# EAGLE design PowerNode (EAGLE 6.5.0)
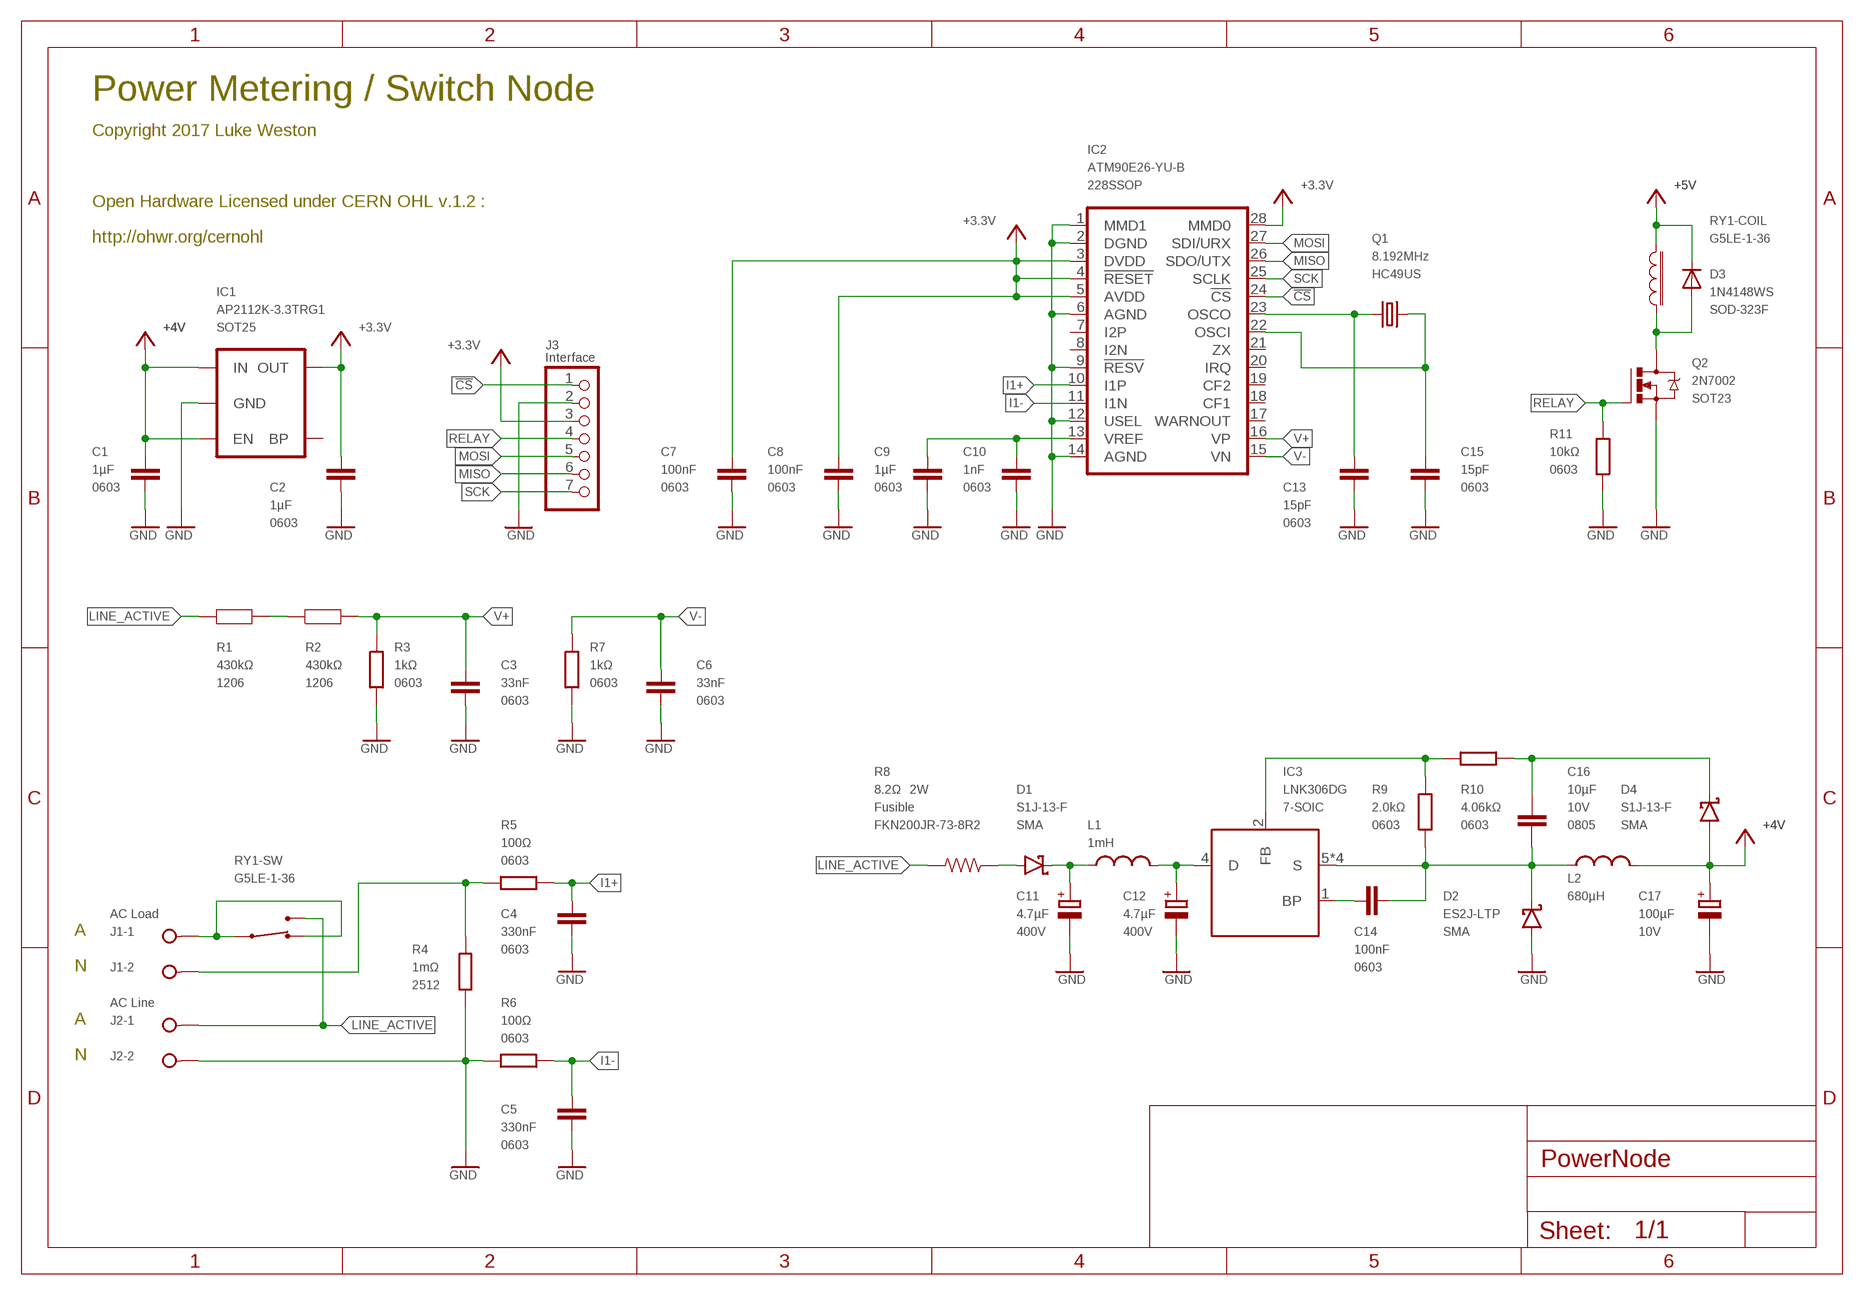
[diagram p0: schematic, sheet 1]

## Parts
C1  1µF  C0603  [0603]
C2  1µF  C0603  [0603]
C3  33nF  C0603  [0603]
C4  330nF  C0603  [0603]
C5  330nF  C0603  [0603]
C6  33nF  C0603  [0603]
C7  100nF  C0603  [0603]
C8  100nF  C0603  [0603]
C9  1µF  C0603  [0603]
C10  1nF  C0603  [0603]
C11  4.7µF  ELECTROLYTIC3.5MM  [ELECTRO-LARGE]
C12  4.7µF  ELECTROLYTIC3.5MM  [ELECTRO-LARGE]
C13  15pF  C0603  [0603]
C14  100nF  C0603  [0603]
C15  15pF  C0603  [0603]
C16  10µF  CAP0805  [0805]
C17  100µF  ELECTROLYTIC2MM  [ELECTRO-SMALL]
D1  S1J-13-F  SCHOTTKY-SMA  [SMA]
D2  ES2J-LTP  SCHOTTKY-SMA  [SMA]
D3  1N4148WS  DIODESOD  [SOD-323]
D4  S1J-13-F  SCHOTTKY-SMA  [SMA]
IC1  AP2112K-3.3TRG1  V_REG_LDOSMD  [SOT23-5]
IC2  ATM90E26-YU-B  ATM90E26  [SSOP-28]
IC3  LNK306DG  LNK304  [SO-8C]
J1  AC Load  W237-02P  [W237-132]
J2  AC Line  W237-02P  [W237-132]
J3  Interface  PINHD-1X7  [1X07]
L1  1mH  LRLB0608  [RLB0608]
L2  680µH  LRLB0914  [RLB0914]
Q1  8.192MHz  CRYSTALHC49S  [HC49/S]
Q2  2N7002  [SOT23-3]
R1  430kΩ  RESISTOR1206  [1206]
R2  430kΩ  RESISTOR1206  [1206]
R3  1kΩ  R0603  [0603]
R4  1mΩ  R-EU_R2512  [R2512]
R5  100Ω  R0603  [0603]
R6  100Ω  R0603  [0603]
R7  1kΩ  R0603  [0603]
R8  8.2Ω  RESISTORFKN200JR-73  [FKN200JR-73]
R9  2.0kΩ  R0603  [0603]
R10  4.06kΩ  R0603  [0603]
R11  10kΩ  R0603  [0603]
RY1  G5LE-1-36  G5LE  [G5LE]

## Nets
!CS: IC2.24(!CS) J3.1
+3.3V: C2.1 C7.2 C8.2 IC1.5(OUT) IC2.3(DVDD) IC2.4(!RESET) IC2.5(AVDD) IC2.28(MMD0) J3.3
+4V: C1.1 C17.+ D3.1(C) D4.A IC1.1(IN) IC1.3(EN) L2.2 RY1.COIL1 ; supply symbol labelled +5V
GND: C1.2 C2.2 C3.1 C4.1 C5.1 C6.1 C7.1 C8.1 C9.2 C10.1 C11.- C12.- C13.1 C15.1 C17.- D2.A IC1.2(GND) IC2.1(MMD1) IC2.2(DGND) IC2.6(AGND) IC2.9(!RESV) IC2.12(USEL) IC2.14(AGND) J2.2 J3.2 Q2.2(S) R3.2 R4.1 R6.2 R7.2 R11.1
I1+: C4.2 IC2.10(I1P) R5.1
I1-: C5.2 IC2.11(I1N) R6.1
LINE_ACTIVE: J2.1 R1.1 R8.1 RY1.NO(-SW:NO)
MISO: IC2.26(SDO/UTX) J3.6
MOSI: IC2.27(SDI/URX) J3.5
N$2: J1.1 RY1.COM(-SW:COM) RY1.NC(-SW:NC)
N$3: J1.2 R4.2 R5.2
N$8: D1.A R8.2
N$9: C11.+ D1.K L1.1
N$10: C12.+ IC3.4(D) L1.2
N$11: C14.1 IC3.1(BP)
N$12: C14.2 C16.1 D2.K IC3.5(S) IC3.6(S) IC3.7(S) IC3.8(S) L2.1 R9.1
N$15: IC3.2(FB) R9.2 R10.2
N$16: C16.2 D4.K R10.1
N$18: D3.2(A) Q2.3(D) RY1.COIL2
N$36: C13.2 IC2.23(OSCO) Q1.1
N$37: C15.2 IC2.22(OSCI) Q1.2
N$38: R1.2 R2.1
RELAY: J3.4 Q2.1(G) R11.2
SCK: IC2.25(SCLK) J3.7
V+: C3.2 IC2.16(VP) R2.2 R3.1
V-: C6.2 IC2.15(VN) R7.1
VREF: C9.1 C10.2 IC2.13(VREF)
Unconnected: IC1.4(BP) IC2.7(I2P) IC2.8(I2N) IC2.17(WARNOUT) IC2.18(CF1) IC2.19(CF2) IC2.20(IRQ) IC2.21(ZX)

## Notes on the sheet
- Power Metering / Switch Node
- Copyright 2017 Luke Weston
- Open Hardware Licensed under CERN OHL v.1.2 :
- http://ohwr.org/cernohl
- A
- N
- A
- N

## Library data of the parts
C1-C10 C13-C15 = freetronics-luke:C; PACKAGE: 0603
C11 C12 = freetronics-luke:ELECTROLYTIC: Electrolytic capacitor; VOLTAGE: 400V
C16 = freetronics-master-v1:CAP: Capacitor Standard 0603 ceramic capacitor, and 0.1" leaded capacitor.; PACKAGE: 0805; VOLTAGE: 10V
C17 = freetronics-luke:ELECTROLYTIC: Electrolytic capacitor; VOLTAGE: 10V
D1 D2 D4 = freetronics-luke:SCHOTTKY: Schottky diode; PACKAGE: SMA
D3 = SparkFun:DIODE: Diode These are standard reverse protection diodes and small signal diodes. SMA package can handle up to about 1A. SOD-323 can handle about 200mA. What the SOD-323 package when ordering, there are some mfgs out there that are 5-pin packages.; PACKAGE: SOD-323F
IC1 = SparkFun:V_REG_LDO: Voltage Regulator LDO Standard 150mA LDO voltage regulator in SOT-23 layout. Micrel part MIC5205. BP (by-pass) pin is used to lower output noise with 470pF cap.; PACKAGE: SOT25
IC2 = ATM90E26:ATM90E26: Single-Phase High-Per formance Wide-Span Energy Metering IC; PACKAGE: 228SSOP
IC3 = freetronics-luke:LNK304: LNK304 Off-Line Switchmode Controller; PACKAGE: 7-SOIC
J1 J2 = con-wago-508:W237-02P: WAGO SREW CLAMP; OC_FARNELL: unknown; OC_NEWARK: unknown
J3 = pinhead:PINHD-1X7: PIN HEADER
L1 L2 = freetronics-luke:L
Q1 = crystal:CRYSTAL: CRYSTAL; OC_FARNELL: 1667008; OC_NEWARK: unknown; PACKAGE: HC49US; PARTNO: 9B-4.096MBBK-B
Q2 = freetronics-luke:2N7002: 2N7002 N-ch MOSFET in SOT-23.; PACKAGE: SOT23
R1 R2 = freetronics-master-v1:RESISTOR: Resistor Basic schematic elements and footprints for 0603, 1206, and PTH 1/10th watt (small) resistors.; PACKAGE: 1206; POWER: 1/4W; TOLERANCE: 1%
R3 R5-R7 R9-R11 = freetronics-luke:R; PACKAGE: 0603
R4 = rcl:R-EU_: RESISTOR, European symbol; PACKAGE: 2512; POWER: 1W; TOLERANCE: 1%
R8 = freetronics-luke:RESISTOR: Resistor Basic schematic elements and footprints for 0603, 1206, and PTH 1/10th watt (small) resistors.; FOO: Fusible; ID: FKN200JR-73-8R2; POWER: 2W
RY1 = freetronics-luke:G5LE

## Net classes
0 default: width 0.152 mm, drill 0.241 mm, clearance 0.152 mm
1 pwr: width 0.356 mm, drill 0.33 mm, clearance 0.254 mm
2 gnd: width 0.152 mm, drill 0.305 mm, clearance 0.152 mm

## Board
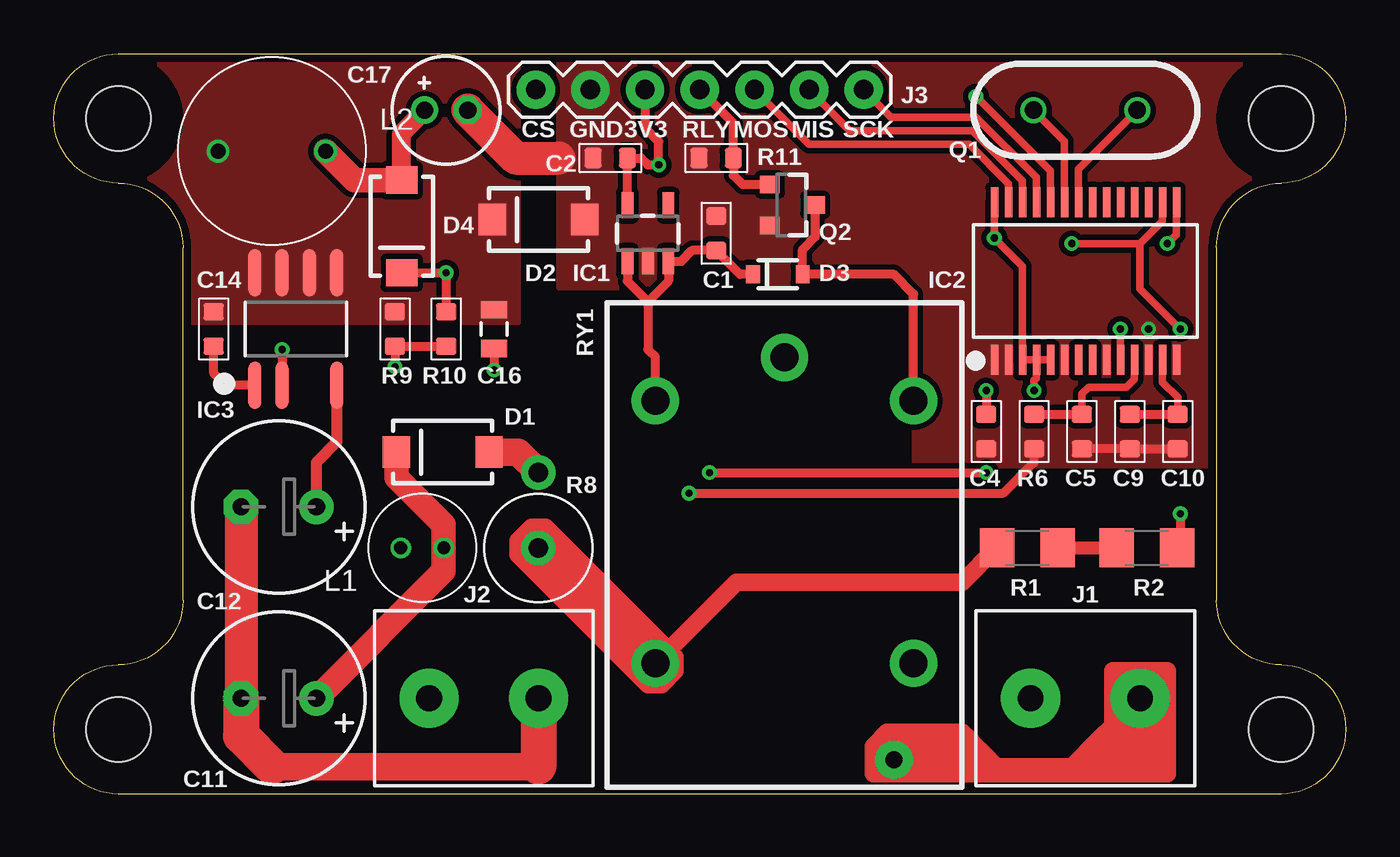
[diagram p1: board, top side]
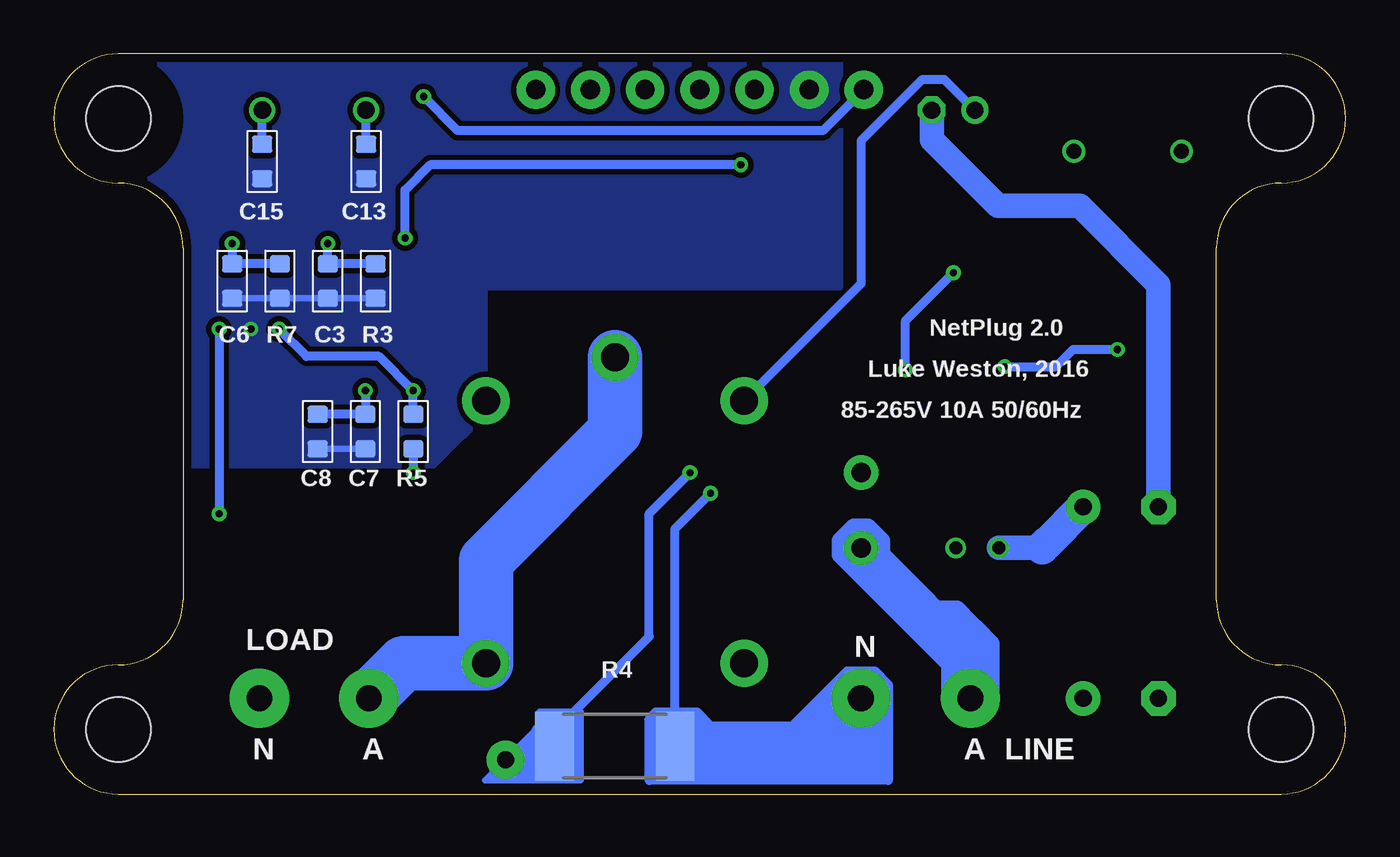
[diagram p2: board, bottom side, seen from below]

Size 60 x 34.37 mm. Coordinates in mm from the lower left corner, seen from the top.
Outline: 3,34.37 57,34.37 arc-90 60,31.36 arc-90 57,28.36 arc90 54,25.36 54,9 arc90 57,6 arc-90 60,3 arc-90 57,0 3,0 arc-90 0,3 arc-90 3,6 arc90 6,9 6,25.36 arc90 3,28.36 arc-90 0,31.36 arc-90 3,34.37
Copper layers (1*16): Top 0.0356mm / dielectric 1.5011mm / Bottom 0.0356mm
Design rules "LaenPCBOrder *": minimum track width 6mil, minimum drill 13mil, track to track 6mil, track to pad 6mil, pad to pad 6mil, via to via 6mil, smd to smd 6mil, copper to edge 15mil, drill to drill 6mil, minimum pad ring 7mil, minimum via ring 7mil, stop-mask expansion 3mil, vias tented up to drill 14mil, thermal gap 10mil
Holes 3 mm at 3,3 57,31.36 57,3 3,31.36
tRestrict: area 0.2,0.2 to 5.8,5.8; area 54.2,28.6 to 59.8,34.1; area 54.2,0.2 to 59.8,5.8; area 0.2,28.6 to 5.8,34.1
bRestrict: area 0.2,0.2 to 5.8,5.8; area 54.2,28.6 to 59.8,34.1; area 54.2,0.2 to 59.8,5.8; area 0.2,28.6 to 5.8,34.1; 16 lines

### Footprints (pad centres in the part's own frame; a part is rotated, then mirrored left to right if it is on the bottom)
0603 = smd 0.8 x 0.95: 1 -0.8,0; 2 0.8,0
ELECTRO-LARGE = drill 0.8 pad 1.6: + -1.75,0 | drill 0.8 pad 1.6 octagon: - 1.75,0
0805 = smd 0.8 x 1.2: 1 -0.9,0; 2 0.9,0
ELECTRO-SMALL = drill 0.8 pad 1.27: + -1,0 | drill 0.8 pad 1.27 octagon: - 1,0
SMA = smd 1.27 x 1.47: A -2.15,0; K 2.15,0
SOD-323 = smd 0.63 x 0.83: 1 -1.15,0; 2 1.15,0
SOT23-5 = smd 0.55 x 1.2: 1 -0.95,-1.3; 2 0,-1.3; 3 0.95,-1.3; 4 0.95,1.3; 5 -0.95,1.3
SSOP-28 = smd 0.348 x 1.397: 1 -4.225,-3.656; 2 -3.575,-3.656; 3 -2.925,-3.656; 4 -2.275,-3.656; 5 -1.625,-3.656; 6 -0.975,-3.656; 7 -0.325,-3.656; 8 0.325,-3.656; 9 0.975,-3.656; 10 1.625,-3.656; 11 2.275,-3.656; 12 2.925,-3.656; 13 3.575,-3.656; 14 4.225,-3.656; 15 4.225,3.656; 16 3.575,3.656; 17 2.925,3.656; 18 2.275,3.656; 19 1.625,3.656; 20 0.975,3.656; 21 0.325,3.656; 22 -0.325,3.656; 23 -0.975,3.656; 24 -1.625,3.656; 25 -2.275,3.656; 26 -2.925,3.656; 27 -3.575,3.656; 28 -4.225,3.656
SO-8C = smd 0.61 x 2.21: 1 -1.905,-2.616; 2 -0.635,-2.616; 4 1.905,-2.616; 5 1.905,2.616; 6 0.635,2.616; 7 -0.635,2.616; 8 -1.905,2.616
W237-132 = drill 1.2 pad 2.75: 1 -2.54,0; 2 2.54,0
1X07 = drill 0.9 pad 1.778: 1 -7.62,0; 2 -5.08,0; 3 -2.54,0; 4 0,0; 5 2.54,0; 6 5.08,0; 7 7.62,0
RLB0608 = drill 0.6: 1 -1,0; 2 1,0
RLB0914 = drill 0.7: 1 -2.5,0; 2 2.5,0
HC49/S = drill 0.813: 1 -2.413,0; 2 2.413,0
SOT23-3 = smd 0.8 x 0.9: 1 -0.95,-1; 2 0.95,-1; 3 0,1.1
1206 = smd 1.6 x 1.8: 1 -1.4,0; 2 1.4,0
R2512 = smd 1.8 x 3.2: 1 -2.8,0; 2 2.8,0
FKN200JR-73 = drill 0.9 pad 1.6: 1 0,0; 2 3.5,0
G5LE = drill 1.3 pad 2.184: COIL1 17.95,14.26; COIL2 17.95,2.26; COM 19.95,8.26; NC 5.75,2.26; NO 5.75,14.26

### Placement (x,y rotation side)
C1  30.77,26.04 90 top
C2  25.84,29.53 180 top
C3  47.27,23.81 90 bottom
C4  43.31,16.83 90 top
C5  47.75,16.83 90 top
C6  51.72,23.81 90 bottom
C7  45.53,16.83 90 bottom
C8  47.75,16.83 90 bottom
C9  49.97,16.83 270 top
C10  52.2,16.83 90 top
C11  10.45,4.45 180 top
C12  10.45,13.34 180 top
C13  45.5,29.37 90 bottom
C14  7.43,21.59 90 top
C15  50.32,29.37 90 bottom
C16  20.45,21.59 270 top
C17  18.22,31.75 0 top
D1  18.06,15.88 180 top
D2  22.51,26.67 180 top
D3  33.62,24.13 0 top
D4  16.16,26.35 270 top
IC1  27.59,26.04 0 top
IC2  47.91,23.81 0 top
IC3  11.24,21.59 0 top
J1  47.91,4.45 0 top
J2  19.97,4.45 0 top
J3  30,32.7 0 top
L1  17.11,11.43 180 top
L2  10.13,29.84 0 top
Q1  47.91,31.75 0 top
Q2  34.26,27.34 270 top
R1  45.21,11.43 0 top
R2  50.77,11.43 0 top
R3  45.05,23.81 270 bottom
R4  33.94,2.22 180 bottom
R5  43.31,16.83 270 bottom
R6  45.53,16.83 270 top
R7  49.5,23.81 270 bottom
R8  22.51,11.43 90 top
R9  15.84,21.59 270 top
R10  18.22,21.59 270 top
R11  30.77,29.53 0 top
RY1  42.2,0.32 90 top

### Tracks (layer width: path | path; a pad name or v marks a point on that pad's centre or on a via)
!CS  (via drill 0.33)
  Top 0.343: IC2.24 46.28,28.93 v42.83,32.38
  Bottom 0.406: J3.1 24.29,30.8 41.24,30.8 v42.83,32.38
+3.3V  (via drill 0.33)
  Top 0.343: IC2.4 45.63,19.32 45.53,19.21 v45.53,18.73 | IC2.4 IC2.3 44.98,24.52 v43.69,25.82 IC2.28 | IC2.4 IC2.5
  Top 0.406: IC1.5 26.64,29.37 C2.1 27.27,29.53 27.59,29.21 v28.09,29.21 28.09,30.29 27.46,30.93 J3.3
  Bottom 0.406: v45.53,18.73 C7.2 C8.2 | v28.09,29.21 42.51,29.21 43.69,28.04 v43.69,25.82
+4V
  Top 0.406: 27.59,22.86 27.59,20.64 27.93,20.29 RY1.COIL1 | IC1.1 26.64,23.81 27.59,22.86 | 27.59,22.86 28.54,23.81 IC1.3 29.15,24.73 29.65,25.23 C1.1 31.87,24.13 D3.1
  Top 0.889: D4.A 16.16,30.69 C17.+
  Top 1.143: D4.A 13.97,28.5 L2.2
  Bottom 0.406: C17.+ 18.65,33.18 19.65,33.18 22.51,30.32 22.51,23.69 RY1.COIL1
GND  (via drill 0.33)
  Top 0.406: C10.1 C9.2 C5.1 | v29.5,13.97 44.1,13.97 45.53,15.4 R6.2
  Top 1.27: 10.13,1.27 22.51,1.27
  Top 1.524: C12.- C11.- | 23.46,29.53 21.45,29.53 C17.-
  Top 1.676: C11.- 8.7,2.7 10.13,1.27 | J2.2 22.51,1.27
  Bottom 0.305: R3.2 C3.1 R7.2 C6.1 | C5.1 R6.2
  Bottom 0.406: v29.5,13.97 31.14,12.32 R4.1 30.45,2.22 | 24.73,3.49 24.73,4.13 | 24.73,4.13 23.14,5.71 21.88,5.71 21.24,5.08 21.24,0.64 32.35,0.64 32.35,3.17 | 32.35,3.17 32.35,3.49 32.03,3.81 30.13,3.81 29.5,3.17 25.68,3.17 24.73,4.13 | 31.72,3.17 32.35,3.17
  Bottom 0.813: 23.46,2.22 23.14,3.49 | 25.37,2.22 25.68,1.91 28.54,1.91 | 30.45,2.22 28.86,2.22 | 28.86,2.22 26.32,2.22 | 26.32,2.22 24.73,1.27 | 24.73,1.27 22.83,3.17 | 22.83,3.17 J2.2 | 23.14,3.49 24.41,1.91 | 25.05,2.54 24.41,2.22 25.37,2.22 | 32.03,2.22 32.03,1.91 | 32.03,1.91 32.03,0.95 22.83,0.95 | 22.51,1.27 24.73,1.27 | 24.73,1.27 25.05,1.27 25.37,0.95 | 22.51,0.95 22.51,1.27 | 32.03,1.91 31.72,1.91 | 31.72,1.91 30.13,1.91 | 30.13,1.91 28.54,1.91 | 22.51,2.54 22.83,1.91 | 22.83,2.86 22.83,1.91 | 22.83,1.91 23.14,1.59 22.51,1.59 | 22.51,1.59 22.51,2.54 | 22.51,2.54 22.51,3.81 | 22.51,3.81 22.83,3.49 | 24.41,1.91 24.73,1.59 30.13,1.59 30.13,1.91 | 30.13,1.91 30.13,2.54 | 30.13,2.54 30.45,2.86 29.81,2.86 | 29.81,2.86 29.18,2.86 | 24.73,2.86 24.1,2.86 J2.2 | 28.23,2.86 29.18,2.86 | 29.18,2.86 29.5,2.54 27.91,2.54 | 27.91,2.54 25.05,2.54 | 25.05,2.54 23.46,2.54 | 23.46,2.54 22.51,2.54 | 30.13,2.54 30.45,3.49 | 32.03,3.49 32.03,2.22 | 32.03,2.22 31.72,1.91 | 31.72,2.22 31.72,3.17 32.03,3.49 | 32.03,3.49 30.45,3.49 | 30.45,3.49 29.81,2.86 | 29.81,2.86 28.86,2.22 | 28.86,2.22 28.54,1.91 | 25.37,2.22 26.32,2.22 | 25.05,2.54 24.41,1.91 | 24.41,1.91 22.83,3.49 | 22.83,3.49 22.19,5.08 21.56,4.45 | 21.56,4.45 22.83,3.17 | 22.83,3.17 22.83,3.49 | 22.51,3.81 21.88,4.45 | 21.88,4.45 22.19,4.76 22.51,4.76 22.83,4.45 23.14,3.49 | 23.14,3.49 23.14,2.86 23.46,2.22 | 23.46,2.22 23.78,1.59 | 22.51,1.27 22.51,1.59 | 22.51,3.81 J2.2 | J2.2 23.46,2.54 | 23.46,2.54 23.14,3.49 | 28.86,2.22 28.23,2.86 | J2.2 21.88,4.45 | 21.56,4.45 21.88,4.45 | 21.88,4.45 21.88,0.95 | 27.91,2.54 28.23,2.86 | 25.68,2.86 24.73,2.86 | 21.88,0.95 21.56,0.95 21.56,4.45 | 21.88,0.95 22.51,0.95 | 22.51,0.95 22.83,0.95 | 22.83,0.95 24.73,2.86
  Bottom 0.813: 24.73,2.86 22.51,5.08 21.88,5.08 | 28.23,2.86 25.68,2.86 | 25.68,2.86 24.1,4.45 J2.2
  Bottom 1.143: C12.- 8.7,23.65 12.35,27.3 16.16,27.3 19.22,30.37 C17.-
  other vias: 50.85,21.59
  pour Top (isolate 0.254, no thermals): 59.98,34.29 23.46,34.29 23.46,23.5 39.97,23.5 39.97,15.24 59.98,15.24
  pour Bottom (isolate 0.254, no thermals): 59.98,34.29 23.46,34.29 23.46,23.5 39.97,23.5 39.97,15.24 59.98,15.24
I1+  (via drill 0.33)
  Top 0.343: IC2.10 v49.53,21.59
  Top 0.406: v43.31,18.73 C4.2
  Bottom 0.406: v49.53,21.59 48.27,20.32 44.89,20.32 v43.31,18.73 C4.2
I1-
  Top 0.343: C5.2 47.75,18.57 48.07,18.89 49.81,18.89 50.19,19.26 IC2.11
  Top 0.406: R6.1 C5.2
LINE_ACTIVE
  Top 0.254: 22.19,11.11 21.88,10.79 | 22.19,11.11 22.51,11.11 | 22.19,11.11 21.56,11.75 22.19,11.75 R8.1 | R8.1 23.46,10.48 | 22.03,10.32 22.03,10.64 22.03,10.95 R8.1
  Top 0.406: R1.1 43.78,11.43
  Top 0.813: 43.78,11.43 42.2,9.84 31.71,9.84 RY1.NO | 25.05,9.53 25.05,10.16 | 25.05,10.16 28.86,6.35 28.86,5.71 28.23,5.08 27.59,5.08 22.03,10.64 21.88,10.79 21.56,11.11 21.56,11.75 22.19,12.38 22.83,12.38 25.05,10.16
  Top 1.27: R8.1 22.57,11.43
  Top 2.54: 22.57,11.43 RY1.NO
  Bottom 0.254: 19.97,8.89 21.24,10.16 21.24,9.84 | 21.24,9.84 19.97,8.57 | 19.97,8.57 19.34,8.57 19.02,8.26 19.34,8.26 19.65,8.26 19.97,8.57 | 22.83,12.38 22.83,11.11 22.19,10.48 22.03,10.64 | 21.56,11.75 22.19,11.75 | 21.56,10.16 22.03,10.64 | 22.03,10.64 22.19,10.79 22.19,11.43 21.88,11.43 | 21.56,11.75 22.03,11.27 22.03,10.95 | 21.56,11.75 21.56,10.16 | 21.56,10.16 21.24,9.84 | 22.03,10.64 22.03,10.95 | 22.03,10.95 R8.1
  Bottom 0.813: 17.11,4.45 16.48,4.45 16.48,5.71 | 18.7,7.94 17.75,7.62 | 23.46,11.43 18.38,6.35 18.38,6.03 | 23.46,11.43 23.46,11.75 22.83,12.38 | J2.1 18.38,4.45 18.38,6.03 | 16.48,6.03 16.48,6.35 | 16.48,6.35 17.75,7.62 | 17.75,7.62 17.75,6.67 18.06,6.35 | 22.83,11.43 23.46,11.43 | 23.46,11.43 23.46,11.11 18.38,6.03 | 17.11,5.71 16.48,5.71 | 22.83,12.38 22.19,12.38 21.56,11.75 21.56,10.79 21.24,10.48 21.56,10.16 | 16.48,5.71 16.48,6.03 | 16.48,6.03 16.8,6.35 | 16.8,6.35 21.88,11.43 22.83,12.38 | 22.83,12.38 22.83,11.75 R8.1 | 18.38,7.3 19.34,8.26 19.65,8.57 18.06,8.57 17.43,7.94 | 16.8,6.35 16.48,6.35 | 16.48,6.35 16.48,6.99 17.11,7.62 | 17.11,7.62 17.43,7.94 | 17.43,7.94 18.7,7.94 | 18.7,7.94 18.7,7.62 18.06,6.99 | 17.43,6.67 17.43,7.3 17.11,7.62
  Bottom 1.27: 22.83,11.43 R8.1
  Bottom 2.54: J2.1 17.43,6.35
MISO
  Top 0.343: IC2.26 44.98,28.48 42.67,30.8 36.98,30.8 J3.6
MOSI
  Top 0.343: IC2.27 44.34,28.34 42.51,30.16 35.08,30.16 J3.5
N$2
  Bottom 2.54: RY1.COM 33.94,16.83 39.94,10.83 RY1.NC 43.75,6.07 J1.1
N$3  (via drill 0.33, 0.8 pad 1.78)
  Top 0.254: 39.97,1.59 v39.02,1.59
  Top 0.406: v30.45,14.92 v43.31,14.92
  Top 0.813: 50.77,4.13 50.13,4.13 | 50.13,4.13 49.81,4.13 | 49.81,4.13 49.5,4.45 49.5,2.54 49.18,2.22 | 49.18,2.22 48.23,1.27 | 41.56,1.59 41.56,1.91 | 41.56,1.91 42.2,2.86 | 42.51,2.54 42.83,2.22 | 42.83,2.22 43.15,1.91 | 43.15,1.91 42.83,1.91 42.51,2.22 | 42.51,2.22 42.51,2.54 | 42.51,2.54 42.2,2.86 | 42.2,2.86 41.56,2.86 | 41.24,2.86 39.66,2.86 | 39.66,2.86 v39.02,1.59 | v39.02,1.59 41.24,2.22 | 41.24,2.22 41.56,2.54 | 41.56,2.54 42.51,2.54 | 42.51,2.22 42.51,1.59 | 41.56,2.54 41.56,2.86 | 39.66,2.86 38.7,2.86 38.07,2.22 38.07,1.91 | 38.07,1.91 38.07,1.59 | 38.07,1.59 39.02,0.95 | 39.34,0.95 39.97,0.95 | 39.97,0.95 40.29,1.91 | 40.29,1.91 39.97,1.59 39.34,0.95 | 49.81,0.95 51.09,1.91 | 51.09,1.91 51.72,2.54 51.72,4.76 50.77,5.71 | 50.77,5.71 50.77,5.4 | 41.24,2.22 42.83,2.22 | 43.15,1.91 43.78,1.27 47.27,1.27 | 47.27,1.27 48.23,1.27 | 41.24,2.54 41.24,2.86 | 38.07,0.95 39.02,0.95 | 39.02,0.95 39.34,0.95 | 39.97,0.95 49.81,0.95 | 49.81,0.95 51.72,0.95 51.72,5.71 51.4,5.71 | 51.4,5.71 50.77,5.71 | 51.09,1.91 51.09,1.59 51.4,1.27 51.09,1.27 50.77,0.95 | 41.56,1.91 41.56,2.22 42.2,2.86 | 41.56,2.86 41.24,2.86 | 39.66,2.86 38.7,1.91 38.38,1.91 | 38.07,1.59 38.07,0.95 | 38.07,0.95 39.66,2.22 40.29,1.91 | 40.61,2.22 40.29,1.91 | 38.07,1.91 38.38,1.91 | 38.38,1.91 v39.02,1.59 | 48.23,1.27 49.18,1.27 | 49.81,1.91 50.13,2.22 50.45,2.22 | 50.45,2.22 50.77,2.54 | 50.77,2.54 51.09,2.86 | 51.09,2.86 51.4,3.17 51.4,4.76 50.77,4.76 51.4,5.4 51.4,5.71 | 50.45,2.22 49.18,0.95 49.18,1.27 | 49.18,1.27 49.81,1.91 | 49.81,1.91 49.5,1.91 49.5,5.71 | 49.5,5.71 50.77,5.71 | 51.09,2.86 50.13,2.86 | 50.13,2.86 49.81,2.54 | 49.81,2.54 49.81,4.13 | 49.81,4.13 49.81,4.76 50.13,5.08 50.45,5.08 50.45,4.76
  Top 0.813: 50.45,4.76 J1.2 50.13,4.13 | 50.13,4.13 50.13,3.81 | 50.13,3.81 50.77,3.17 | 50.77,3.17 50.77,3.81 | 50.77,3.17 50.77,2.54 | 50.77,2.54 50.45,2.54 50.13,2.86 | 50.13,2.86 50.13,3.81 | 50.13,3.81 49.81,4.13 | 49.81,4.13 50.45,4.76 | 49.5,5.71 49.18,5.71 49.18,3.17 | 49.18,3.17 49.18,2.22 | 49.81,2.54 48.55,2.54 | 48.55,2.54 47.27,1.27 | 48.55,2.54 49.18,3.17
  Top 1.778: 42.51,1.59 40.29,1.91 40.29,1.59 39.97,1.59
  Bottom 0.254: v39.02,1.59 38.7,1.91 | 38.7,0.95 39.34,1.91 | 35.84,3.81 35.84,3.49
  Bottom 0.305: 36.16,3.17 36.16,3.81 | 36.16,3.81 36.8,3.81 | 36.8,3.81 37.11,3.81 | 37.11,3.81 37.43,3.81 37.43,3.17 | 38.7,0.95 39.02,1.27 39.97,0.64 | 39.97,0.64 v39.02,1.59 37.43,3.17 | 39.66,0.64 38.7,0.64 | 38.7,0.64 37.43,1.91 | 37.11,2.86 37.11,3.81 | 36.16,3.81 35.84,3.81 35.53,3.81 35.53,0.64 38.7,0.64 | 36.48,3.17 36.48,3.49 36.8,3.81 | 36.8,3.81 37.43,3.17 | 39.97,0.64 39.66,0.64 | 39.66,0.64 37.75,2.54 37.75,1.91
  Bottom 0.406: R5.2 v43.31,14.92 | 37.43,2.22 R4.2 36.74,2.92 36.48,3.17 35.84,3.81 32.35,7.3 32.35,13.02 v30.45,14.92 | 37.43,1.27 38.7,1.27 | 39.02,1.27 39.34,1.27 38.7,0.95
  Bottom 0.813: 37.43,1.91 37.43,2.22 | 37.43,2.22 37.11,1.91 | v39.02,1.59 37.69,1.27 R4.2 | 36.8,2.54 36.8,3.49 35.84,3.49 35.84,0.95 38.7,0.95 | v39.02,1.59 39.34,0.95 | 39.34,0.95 38.7,0.95 | 38.7,0.95 38.7,1.27 | 38.7,1.27 39.34,0.95 | 37.43,1.91 37.75,1.91 38.7,1.91 39.02,1.91 | v39.02,1.59 39.34,1.91 39.02,1.91 | v39.02,1.59 38.7,0.95 | 38.7,1.27 39.02,1.27 v39.02,1.59 | 38.7,1.27 37.75,1.27 37.43,1.59 37.43,1.91 | 37.43,2.22 37.43,2.86 | 39.02,1.91 v39.02,1.59 | v39.02,1.59 38.7,1.27 | 38.7,1.27 37.43,1.91
N$8
  Top 1.27: D1.A 21.56,15.88 R8.2
N$9
  Top 1.143: D1.K 15.91,14.69 18.11,12.49 L1.1 18.11,10.36 C11.+
N$10
  Top 0.508: IC3.4 13.14,16.35 12.2,15.4 C12.+
  Bottom 1.143: L1.2 14.1,11.43
  Bottom 1.524: 14.1,11.43 13.86,11.67 C12.+
N$11
  Top 0.406: IC3.1 7.98,18.97 7.43,19.53 C14.1
N$12
  pour Top (isolate 0.254, no thermals): 0,34.37 21.56,34.37 21.56,21.91 0,21.91
N$15  (via drill 0.33)
  Top 0.406: v15.84,19.84 R9.2 R10.2 | v10.6,20.64 IC3.2
  Bottom 0.406: v10.6,20.64 12.67,20.64 13.46,19.84 v15.84,19.84
N$16  (via drill 0.33)
  Top 0.406: D4.K v18.22,24.2 R10.1 | C16.2 v20.45,19.68
  Bottom 0.406: v20.45,19.68 20.45,21.98 v18.22,24.2
N$18
  Top 0.406: RY1.COIL2 39.94,23.21 39.02,24.13 D3.2 34.77,25.28 35.36,25.86 Q2.3
N$36
  Top 0.343: IC2.23 46.94,30.31 Q1.1
  Bottom 0.406: C13.2 Q1.1
N$37
  Top 0.343: IC2.22 47.59,29.01 Q1.2
  Bottom 0.406: C15.2 Q1.2
N$38
  Top 0.61: R1.2 R2.1
RELAY
  Top 0.406: J3.4 31.57,31.14 R11.2 31.57,28.73 32,28.29 Q2.1
SCK
  Top 0.343: J3.7 38.89,31.43 42.83,31.43 45.63,28.63 IC2.25
V+  (via drill 0.33)
  Top 0.305: 52.33,11.59 R2.2
  Top 0.343: v47.27,25.56 50.45,25.56 | 50.45,25.56 51.48,26.59 IC2.16 | 50.45,25.56 50.45,23.47 v52.33,21.59
  Top 0.406: v52.33,13.02 52.33,11.59
  Bottom 0.406: R3.1 C3.2 v47.27,25.56 | v52.33,21.59 v52.33,13.02
V-  (via drill 0.33)
  Top 0.343: IC2.15 52.13,25.97 v51.72,25.56
  Bottom 0.406: v51.72,25.56 C6.2 R7.1
VREF
  Top 0.343: IC2.13 51.48,19.13 52.2,18.41 C10.2
  Top 0.406: C9.1 C10.2

### Text on the board
tPlace: CS | GND | 3V3 | RLY | MOS | MIS | SCK
bPlace: NetPlug 2.0 | Luke Weston, 2016 | 85-265V 10A 50/60Hz | LOAD | N | LINE | A | A | N